# Altium schematic sheet MAIN.SchDoc
size 431 x 279 mm
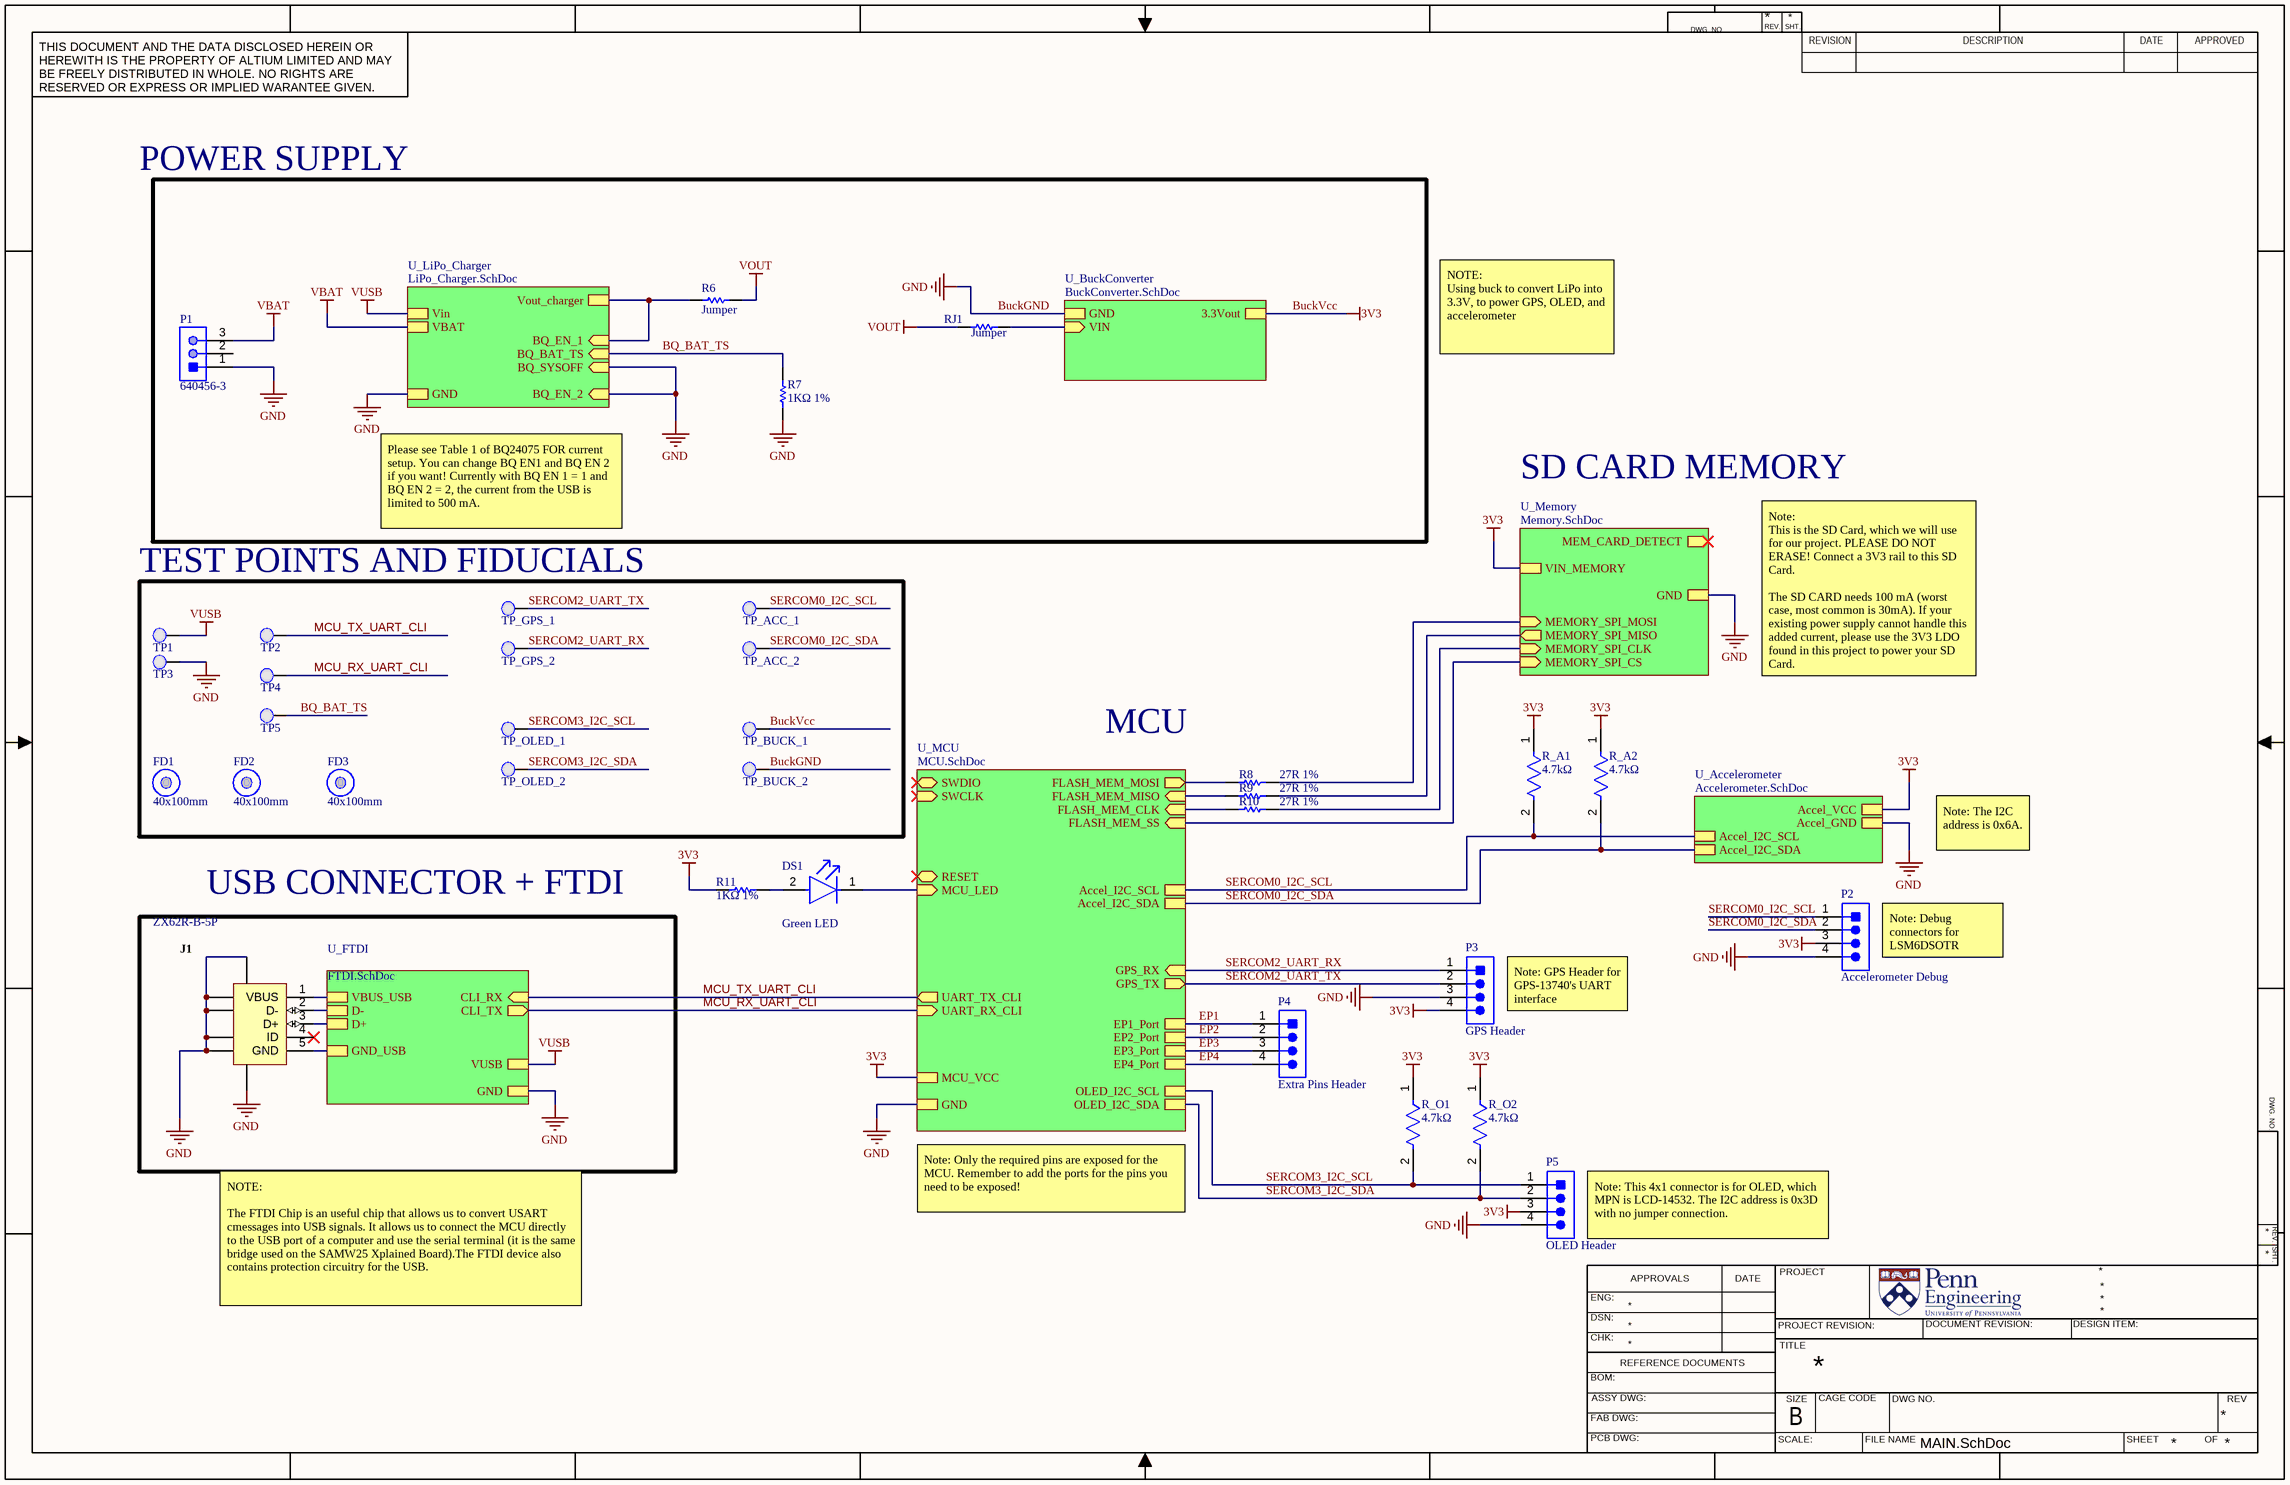
[diagram p0: MAIN.SchDoc]

## Parts
DS1  Green LED  [FP-LTST-C191KGKT-MFG]
FD1  40x100mm  [Fiducial_FT]
FD2  40x100mm  [Fiducial_FT]
FD3  40x100mm  [Fiducial_FT]
J1  ZX62R-B-5P  [HIRO-ZX62R-B-5P_V]
P1  640456-3  [TECO-640456-3]
P2  Accelerometer Debug  [TECO-640456-4]
P3  GPS Header  [TECO-640456-4]
P4  Extra Pins Header  [TECO-640456-4]
P5  OLED Header  [TECO-640456-4]
R6  Jumper  [RESC0805(2012)_N]
R7  1KΩ 1%  [RESC1609X50X30LL10T20]
R8  27R 1%  [RESC0603(1608)_N]
R9  27R 1%  [RESC0603(1608)_N]
R10  27R 1%  [RESC0603(1608)_N]
R11  1KΩ 1%  [RESC1609X50X30LL10T20]
R_A1  4.7kΩ  [FP-AT0603-MFG]
R_A2  4.7kΩ  [FP-AT0603-MFG]
R_O1  4.7kΩ  [FP-AT0603-MFG]
R_O2  4.7kΩ  [FP-AT0603-MFG]
RJ1  Jumper  [RESC1609X50X30LL10T20]
TP1  0.1" Pad  [PCBComponent]  (value not drawn)
TP2  0.1" Pad  [PCBComponent]  (value not drawn)
TP3  0.1" Pad  [PCBComponent]  (value not drawn)
TP4  0.1" Pad  [PCBComponent]  (value not drawn)
TP5  0.1" Pad  [PCBComponent]  (value not drawn)
TP_ACC_1  0.1" Pad  [PCBComponent]  (value not drawn)
TP_ACC_2  0.1" Pad  [PCBComponent]  (value not drawn)
TP_BUCK_1  0.1" Pad  [PCBComponent]  (value not drawn)
TP_BUCK_2  0.1" Pad  [PCBComponent]  (value not drawn)
TP_GPS_1  0.1" Pad  [PCBComponent]  (value not drawn)
TP_GPS_2  0.1" Pad  [PCBComponent]  (value not drawn)
TP_OLED_1  0.1" Pad  [PCBComponent]  (value not drawn)
TP_OLED_2  0.1" Pad  [PCBComponent]  (value not drawn)

## Blocks framed on the sheet
TEST POINTS AND FIDUCIALS: FD1-FD3 TP1-TP5 TP_ACC_1 TP_ACC_2 TP_BUCK_1 TP_BUCK_2 TP_GPS_1 TP_GPS_2 TP_OLED_1 TP_OLED_2
USB CONNECTOR + FTDI: J1

## Sub-sheets
U_Accelerometer = Accelerometer.SchDoc: Accel_VCC, Accel_GND, Accel_I2C_SCL, Accel_I2C_SDA
U_BuckConverter = BuckConverter.SchDoc: VIN (in), GND, 3.3Vout
U_FTDI = FTDI.SchDoc: CLI_RX (in), CLI_TX (out), VUSB, GND, VBUS_USB, D-, D+, GND_USB
U_LiPo_Charger = LiPo_Charger.SchDoc: BQ_EN_2 (in), BQ_SYSOFF (in), BQ_EN_1 (in), BQ_BAT_TS (in), Vin, GND, VBAT, Vout_charger
U_MCU = MCU.SchDoc: SWDIO (bidir), SWCLK (in), UART_TX_CLI (out), UART_RX_CLI (in), FLASH_MEM_SS (in), FLASH_MEM_CLK (in), FLASH_MEM_MISO (in), FLASH_MEM_MOSI (out), RESET (bidir), MCU_LED (in), MCU_VCC, GND, GPS_RX (in), GPS_TX (out), OLED_I2C_SCL, OLED_I2C_SDA, Accel_I2C_SCL, Accel_I2C_SDA, EP2_Port, EP3_Port, EP4_Port, EP1_Port
U_Memory = Memory.SchDoc: MEMORY_SPI_MOSI (in), MEMORY_SPI_MISO (out), MEMORY_SPI_CLK (in), MEMORY_SPI_CS (in), MEM_CARD_DETECT (out), VIN_MEMORY, GND

## Nets
BuckGND: J1.6(SHLD) J1.7(SHLD) J1.8(SHLD) J1.9(SHLD) J1.10(SHLD) J1.11(SHLD) P1.1 P2.4 P3.3 P5.4 R7.2 TP3.1(PAD) TP_BUCK_2.1(PAD) ; sheet U_FTDI/GND, sheet U_Memory/GND, sheet U_LiPo_Charger/BQ_EN_2, sheet U_LiPo_Charger/BQ_SYSOFF, sheet U_LiPo_Charger/GND, sheet U_BuckConverter/GND, sheet U_Accelerometer/Accel_GND, sheet U_MCU/GND  [also labelled GND]
BuckVcc: P2.3 P3.4 P5.3 R11.1 R_A1.1 R_A2.1 R_O1.1 R_O2.1 TP_BUCK_1.1(PAD) ; sheet U_Memory/VIN_MEMORY, sheet U_BuckConverter/3.3Vout, sheet U_Accelerometer/Accel_VCC, sheet U_MCU/MCU_VCC  [also labelled 3V3]
VBAT: P1.3 ; sheet U_LiPo_Charger/VBAT
VOUT: R6.2 RJ1.1
VUSB: TP1.1(PAD) ; sheet U_FTDI/VUSB, sheet U_LiPo_Charger/Vin
BQ_BAT_TS: R7.1 TP5.1(PAD) ; sheet U_LiPo_Charger/BQ_BAT_TS
EP1: P4.1 ; sheet U_MCU/EP1_Port
EP2: P4.2 ; sheet U_MCU/EP2_Port
EP3: P4.3 ; sheet U_MCU/EP3_Port
EP4: P4.4 ; sheet U_MCU/EP4_Port
MCU_RX_UART_CLI: TP4.1(PAD) ; sheet U_FTDI/CLI_TX, sheet U_MCU/UART_RX_CLI
MCU_TX_UART_CLI: TP2.1(PAD) ; sheet U_FTDI/CLI_RX, sheet U_MCU/UART_TX_CLI
SERCOM0_I2C_SCL: P2.1 R_A1.2 TP_ACC_1.1(PAD) ; sheet U_Accelerometer/Accel_I2C_SCL, sheet U_MCU/Accel_I2C_SCL
SERCOM0_I2C_SDA: P2.2 R_A2.2 TP_ACC_2.1(PAD) ; sheet U_Accelerometer/Accel_I2C_SDA, sheet U_MCU/Accel_I2C_SDA
SERCOM2_UART_RX: P3.1 TP_GPS_2.1(PAD) ; sheet U_MCU/GPS_RX
SERCOM2_UART_TX: P3.2 TP_GPS_1.1(PAD) ; sheet U_MCU/GPS_TX
SERCOM3_I2C_SCL: P5.1 R_O1.2 TP_OLED_1.1(PAD) ; sheet U_MCU/OLED_I2C_SCL
SERCOM3_I2C_SDA: P5.2 R_O2.2 TP_OLED_2.1(PAD) ; sheet U_MCU/OLED_I2C_SDA
NetDS1_1: DS1.1(C) ; sheet U_MCU/MCU_LED
NetDS1_2: DS1.2(A) R11.2
NetJ1_1: J1.1(VBUS) ; sheet U_FTDI/VBUS_USB
NetJ1_2: J1.2(D-) ; sheet U_FTDI/D-
NetJ1_3: J1.3(D+) ; sheet U_FTDI/D+
NetJ1_5: J1.5(GND) ; sheet U_FTDI/GND_USB
NetR6_1: R6.1 ; sheet U_LiPo_Charger/BQ_EN_1, sheet U_LiPo_Charger/Vout_charger
NetR8_1: R8.1 ; sheet U_MCU/FLASH_MEM_MOSI
NetR8_2: R8.2 ; sheet U_Memory/MEMORY_SPI_MOSI
NetR9_1: R9.1 ; sheet U_MCU/FLASH_MEM_MISO
NetR9_2: R9.2 ; sheet U_Memory/MEMORY_SPI_MISO
NetR10_1: R10.1 ; sheet U_MCU/FLASH_MEM_CLK
NetR10_2: R10.2 ; sheet U_Memory/MEMORY_SPI_CLK
NetRJ1_2: RJ1.2 ; sheet U_BuckConverter/VIN
(unnamed): sheet U_Memory/MEMORY_SPI_CS, sheet U_MCU/FLASH_MEM_SS

Not connected (* = marked no-connect by the designer): J1 4(ID)*; P1 2

## Notes on the sheet
- POWER SUPPLY
- NOTE:
  Using buck to convert LiPo into 3.3V, to power GPS, OLED, and accelerometer
- SD CARD MEMORY
- Please see Table 1 of BQ24075 FOR current setup. You can change BQ EN1 and BQ EN 2 if you want! Currently with BQ EN 1 = 1 and BQ EN 2 = 2, the current from the USB is limited to 500 mA.
- Note:
  This is the SD Card, which we will use for our project. PLEASE DO NOT ERASE! Connect a 3V3 rail to this SD Card.
  The SD CARD needs 100 mA (worst case, most common is 30mA). If your existing power supply cannot handle this added current, please use the 3V3 LDO found in this project to power your SD Card.
- MCU
- Note: The I2C address is 0x6A.
- (near P2) Note: Debug connectors for LSM6DSOTR accelerometer's I2C.
- (near P3) Note: GPS Header for GPS-13740's UART interface
- Note: Only the required pins are exposed for the MCU. Remember to add the ports for the pins you need to be exposed!
- (near P5) Note: This 4x1 connector is for OLED, which MPN is LCD-14532. The I2C address is 0x3D with no jumper connection.
- NOTE:
  The FTDI Chip is an useful chip that allows us to convert USART cmessages into USB signals. It allows us to connect the MCU directly to the USB port of a computer and use the serial terminal (it is the same bridge used on the SAMW25 Xplained Board).The FTDI device also contains protection circuitry for the USB.
- DWG. NO.
- REV.
- SHT.
- THIS DOCUMENT AND THE DATA DISCLOSED HEREIN OR HEREWITH IS THE PROPERTY OF ALTIUM LIMITED AND MAY BE FREELY DISTRIBUTED IN WHOLE. NO RIGHTS ARE RESERVED OR EXPRESS OR IMPLIED WARANTEE GIVEN.
- REVISION
- DESCRIPTION
- DATE
- APPROVED
- ENG:
- APPROVALS
- PROJECT
- DSN:
- CHK:
- REFERENCE DOCUMENTS
- PROJECT REVISION:
- TITLE
- DOCUMENT REVISION:
- DESIGN ITEM:
- BOM:
- FAB DWG:
- PCB DWG:
- ASSY DWG:
- SCALE:
- SIZE
- B
- CAGE CODE
- FILE NAME
- DWG NO.
- SHEET
- OF
- REV

## Library data of the parts
DS1 = CMP-2000-05198-2: LED GREEN CLEAR SMD; Forward Voltage: 2V; Number of Elements: 1; Viewing Angle: 130°; Forward Current: 30mA; Luminous Intensity: 35mcd; Reverse Voltage: 5V; Power Dissipation: 75mW; Dominant Wavelength: 571nm; Lens Color: Colorless; Lens Style: Rectangular; Test Current: 20mA; Wavelength: 574nm; Packaging: Tape and Reel; Case/Package: 0603; Case Code (Imperial): 0603; Case Code (Metric): 1608; Color: Green; Depth: 0.8mm; Height: 0.55mm; Illumination Color: Green; Lead Free: Lead Free; Length: 1.6mm; Lens Transparency: Clear; Max Operating Temperature: 85°C; Max Power Dissipation: 75mW; Min Operating Temperature: -55°C; Mount: Surface Mount; Number of LEDs: 1; Number of Pins: 2; Package Quantity: 1; Power Rating: 75mW; Radiation Hardening: No; Width: 0.8mm
FD1-FD3 = CMP-00174-A.4: Fiducial 40x100mm
J1 = CMP-0031-00001-1: Connector; USBMicro-B,Reverse type, SMT; 5 Position; Right Angle; DatasheetVersion: 08/2010; Operating Temperature: -30 to 85 degC; Mounting Technology: Surface Mount; PartNumber: ZX62R-B-5P; PackageReference: ZX62R-B-5P; ComponentLink2URL: http://www.hirose.co.jp/cataloge_hp/e24200011.pdf; ComponentLink1URL: http://www.hirose.com/â€Ž; ComponentLink2Description: Datasheet; PackageDescription: 5-Pin USB Micro-B R/A Connector; ComponentLink1Description: Manufacturer URL
P1 = CMP-2000-05418-1: Male Header, Pitch 2.54 mm, 1 x 3 Position, Height 10.03 mm, Tail Length 3.56 mm, -55 to 105 degC; Manufacturer: TE Connectivity; Agency Approvals: CSA,UL; Angle: Straight; Number of Positions: 3; Standards: RoHSCompliant,ELVCompliant,UL94V-0; Current, Rating: 5 / A; Connector Type: MTA-100; Mount Angle: Vertical; Material, Housing: Polyester; Temperature, Operating: -55to+105 / degC; Voltage, Rating: 250 / V; Color, Housing: White; Contact Centerline Spacing: 0.100 / in.; Special Features: Pinstrip; Material, Contact: CopperAlloy; Contact Termination Area Plating: Tin; Primary Type: InterconnectSystem; Pin Spacing: 0.1 / "; Brand/Series: MTA-100Series; Mounting Hole Size: 0.04 / "; Manufacturer URL: http://www.te.com/; Datasheet URL: https://datasheet.ciiva.com/16456/eng-ds-82056-mta-0608-16456886.pdf; Flammability Rating: UL94V-0; Mounting Type: PCMount; Contact Mating Area Plating: Tin; Datasheet Version: Jun-08; Number of Rows: 1; Termination: Solder; Type: PCBPlug; Length, Pin: 0.14 / "; Color: White; Contact Plating: Tin; Contact Shape: Square; Number of Contacts: 3; Size, Post: 0.025 / in.; Length, Terminal Post: 0.14 / in.; Length, Overall: 0.3 / "
P2-P5 = CMP-2000-05419-1: Male Header, Pitch 2.54 mm, 1 x 4 Position, Height 10.03 mm, Tail Length 3.56 mm, RoHS, Bulk; Manufacturer: TE Connectivity; Material, Housing: Polyester; Primary Type: InterconnectSystem; Mount Angle: Vertical; Color, Housing: White; Current, Rating: 5 / A; Agency Approvals: CSA,UL; Contact Termination Area Plating: Tin; Temperature, Operating: -55to+105 / degC; Standards: RoHSCompliant,ELVCompliant,UL94V-0; Number of Positions: 4; Brand/Series: MTA-100Series; Angle: Straight; Pin Spacing: 0.1 / "; Material, Contact: CopperAlloy; Connector Type: MTA-100; Special Features: Pinstrip; Mounting Hole Size: 0.04 / "; Contact Centerline Spacing: 0.100 / in.; Voltage, Rating: 250 / V; Manufacturer URL: http://www.te.com/; Length, Pin: 0.14 / "; Length, Overall: 0.4 / "; Color: White; Flammability Rating: UL94V-0; Mounting Type: PCMount; Termination: Solder; Datasheet URL: https://datasheet.ciiva.com/16286/eng-ds-82056-mta-0608-16286228.pdf; Number of Contacts: 4; Contact Shape: Square; Contact Mating Area Plating: Tin; Length, Terminal Post: 0.14 / in.; Size, Post: 0.025 / in.; Contact Plating: Tin; Type: PCBPlug; Datasheet Version: Dec-14; Number of Rows: 1
R6 = CMP-1013-00001-1: Jumper 0805 (2012 Metric); Case-EIA: 0805; Value: 0.00 Ohm; Tolerance: None; Case-Metric: 2012; Technology: SMT; Power: None
R7 R11 = CMP-1012-00510-2: 1KΩ 1%CRCW06031K00FKEB; Manufacturer: Vishay Dale; Part Number: CRCW06031K00FKEB
R8-R10 = CMP-1012-00331-1: 27R 0.1W 1% 0603 (1608 Metric)  SMD; Case-EIA: 0603; Value: 27.00 Ohm; Case-Metric: 1608; Technology: SMT; Tolerance: 1 %; Power: 0.1 W
R_A1 R_A2 R_O1 R_O2 = CMP-03412-008985-1: RES SMD 4.7K OHM 0.5% 1/10W 0603; Manufacturer: Yageo; Manufacturer Part Number: AT0603DRD074K7L; Power Rating: 0.1W; Voltage Rating: 75V; Tolerance: 0.005; Temperature Coefficient: 25 ppm/°C; Automotive Grade: Grade 0; ComponentLink2URL: http://www.yageo.com/documents/recent/PYu-AT_51_RoHS_L_5.pdf; Digikey Description: RES SMD 4.7K OHM 0.5% 1/10W 0603; Automotive: Yes; Temperature: -55°C to +155°C; Ipc Land Pattern Name: RESC16080X45; RoHS: TRUE; Temperature Range Low: -55°C; Value: 4.7KΩ; Temperature Range High: +155°C; Device Class L3: Chip SMD Resistors; Series: AT; Device Class L1: Passive Components; Package: AT0603; Resistance: 4.7KΩ; ComponentLink2Description: Datasheet; Mouser Description: Res Thin Film 0603 4.7K Ohm 0.5% 0.1W(1/10W) ±25ppm/C Sulfur Resistant Epoxy Pad SMD Automotive T/R; Lead Free: Yes; Category: Res; Footprint Url: http://www.yageo.com/exep/pages/download/literatures/PYu-R_Mount_9.pdf; Device Class L2: Resistors; Height: 0.55mm; Octopart: https://octopart.com/at0603drd074k7l-yageo-71378151
RJ1 = CMP-1012-00001-2: 0 Ohm CRCW06030000Z0EC; Manufacturer: Vishay Dale; Part Number: CRCW06030000Z0EC
TP1-TP5 TP_ACC_1 TP_ACC_2 TP_BUCK_1 TP_BUCK_2 TP_GPS_1 TP_GPS_2 TP_OLED_1 TP_OLED_2 = 0.1" Pad-A.4